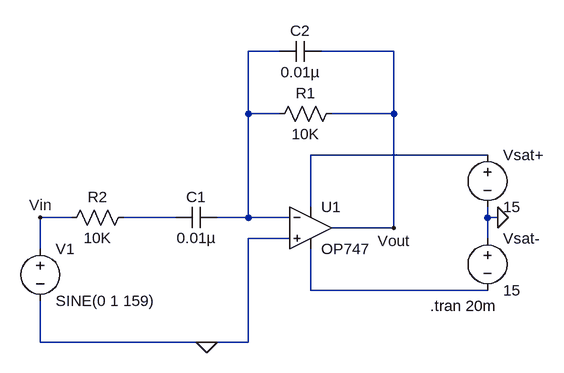
[diagram p0: schematic DIFFERENTIATOR_PRACTICAL.asc]
DIFFERENTIATOR_PRACTICAL.asc, the LTspice schematic file:
Version 4
SHEET 1 1584 680
WIRE 336 -112 288 -112
WIRE 512 -112 400 -112
WIRE 288 -16 288 -112
WIRE 336 -16 288 -16
WIRE 512 -16 512 -112
WIRE 512 -16 416 -16
WIRE 656 48 384 48
WIRE 384 128 384 48
WIRE 16 144 -32 144
WIRE 176 144 96 144
WIRE 288 144 288 -16
WIRE 288 144 240 144
WIRE 352 144 288 144
WIRE 656 144 656 128
WIRE 672 144 656 144
WIRE 512 160 512 -16
WIRE 512 160 416 160
WIRE 352 176 288 176
WIRE 656 176 656 144
WIRE -32 192 -32 144
WIRE 384 256 384 192
WIRE 656 256 384 256
WIRE -32 336 -32 272
WIRE 224 336 -32 336
WIRE 288 336 288 176
WIRE 288 336 224 336
FLAG 672 144 0
FLAG 224 336 0
FLAG -32 144 Vin
FLAG 512 160 Vout
SYMBOL OpAmps\\OP747 384 96 R0
SYMATTR InstName U1
SYMBOL voltage 656 32 R0
WINDOW 123 0 0 Left 0
WINDOW 39 0 0 Left 0
SYMATTR InstName Vsat+
SYMATTR Value 15
SYMBOL voltage 656 160 R0
WINDOW 123 0 0 Left 0
WINDOW 39 0 0 Left 0
SYMATTR InstName Vsat-
SYMATTR Value 15
SYMBOL cap 240 128 R90
WINDOW 0 0 32 VBottom 2
WINDOW 3 32 32 VTop 2
SYMATTR InstName C1
SYMATTR Value 0.01µ
SYMBOL res 432 -32 R90
WINDOW 0 0 56 VBottom 2
WINDOW 3 32 56 VTop 2
SYMATTR InstName R1
SYMATTR Value 10K
SYMBOL voltage -32 176 R0
WINDOW 123 0 0 Left 0
WINDOW 39 0 0 Left 0
SYMATTR InstName V1
SYMATTR Value SINE(0 1 159)
SYMBOL res 112 128 R90
WINDOW 0 0 56 VBottom 2
WINDOW 3 32 56 VTop 2
SYMATTR InstName R2
SYMATTR Value 10K
SYMBOL cap 400 -128 R90
WINDOW 0 0 32 VBottom 2
WINDOW 3 32 32 VTop 2
SYMATTR InstName C2
SYMATTR Value 0.01µ
TEXT 568 280 Left 2 !.tran 20m

The netlist it stands for:
* DIFFERENTIATOR_PRACTICAL.asc
XU1 0 N001 N002 N004 Vout OP747  ; pins In+ In- V+ V- OUT
Vsat+ N002 0 15
Vsat- 0 N004 15
C1 N001 N003 0.01µ
R1 Vout N001 10K
V1 Vin 0 SINE(0 1 159)
R2 N003 Vin 10K
C2 Vout N001 0.01µ
.tran 20m
.backanno
.end